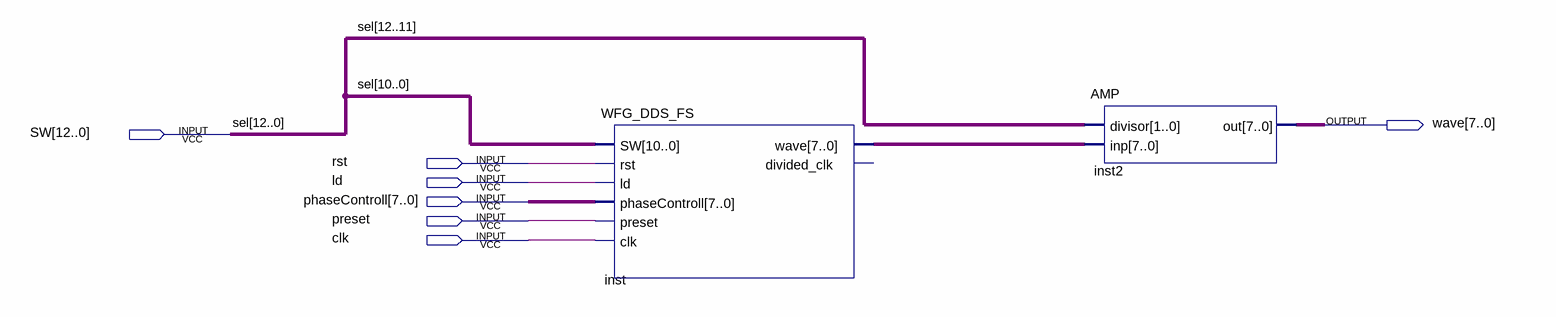
[diagram p0: schematic sheet]
// Quartus schematic WFG_DDS_FS_AMP.bdf as structural Verilog: 2 symbols, 7 pins
module WFG_DDS_FS_AMP (
  input  [12:0] SW,
  input  rst,
  input  ld,
  input  [7:0] phaseControll,
  input  preset,
  input  clk,
  output [7:0] wave
);

  wire [7:0] inst_wave;

  WFG_DDS_FS inst (
    .SW(SW[10:0]), .rst(rst), .ld(ld), .phaseControll(phaseControll), .preset(preset), .clk(clk),
    .wave(inst_wave));  // open: divided_clk
  AMP inst2 (.divisor(SW[12:11]), .inp(inst_wave), .out(wave));

  // Other names for the same wires on the sheet: sel[12:0] = SW
endmodule
